# EAGLE design Jacdaptor_FeatherWing-RevC (EAGLE 9.6.2)
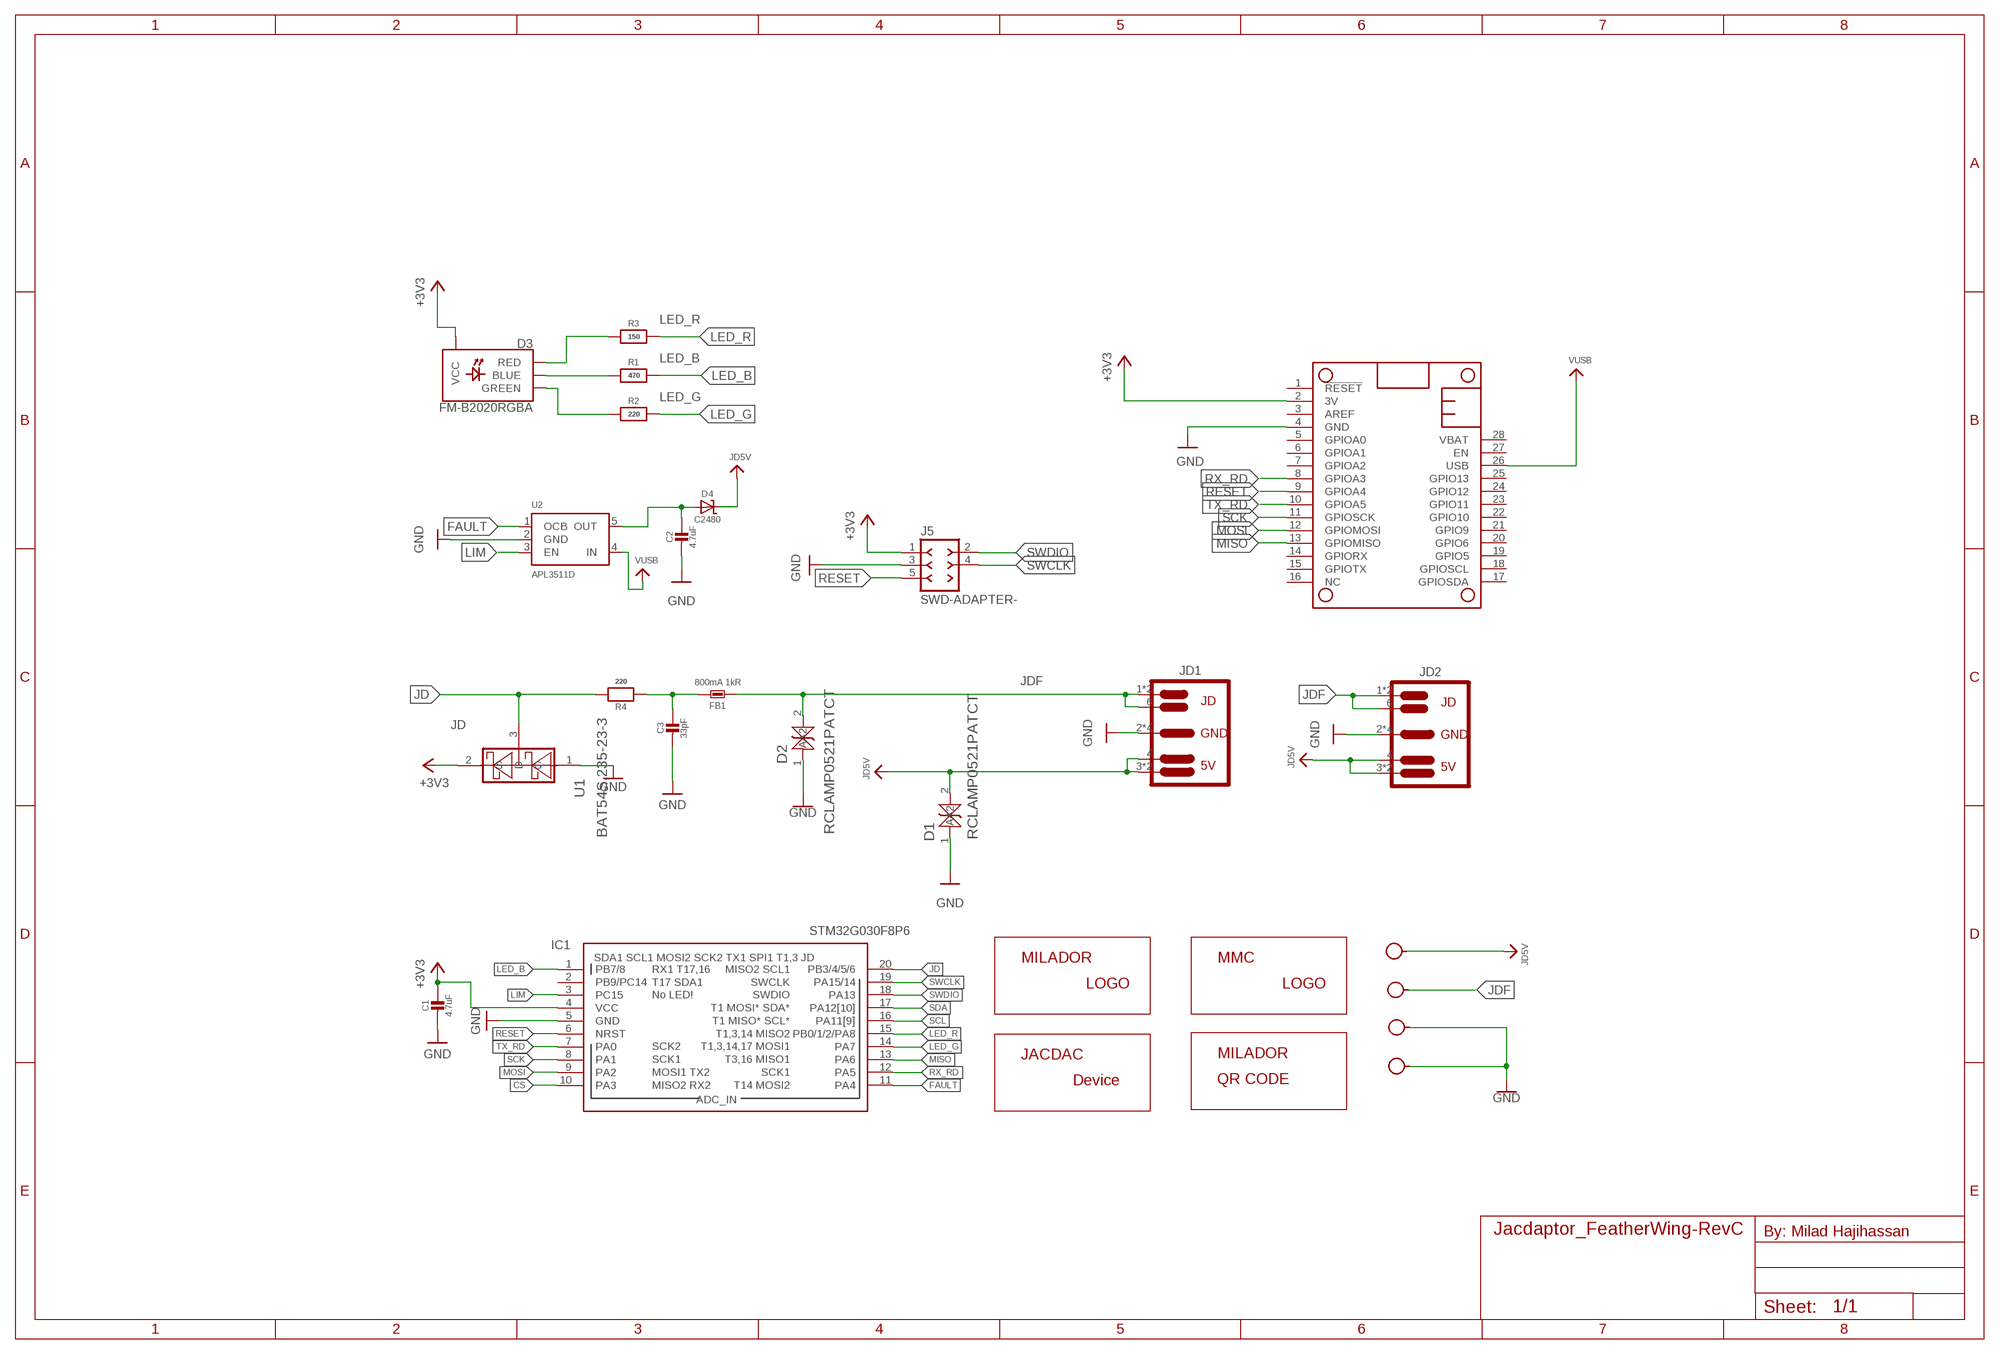
[diagram p0: schematic, sheet 1]

## Parts
C1  4.7uF  CAP_CERAMIC-0603  [0603]
C2  4.7uF  CAP_CERAMIC-0603  [0603]
C3  33pF  CAP_CERAMIC-0603  [0603]
D1  RCLAMP0521PATCT  DIODE-ZENER-AA-RCLAMP0521PATCT  [DIODE-ZENER-0402]
D2  RCLAMP0521PATCT  DIODE-ZENER-AA-RCLAMP0521PATCT  [DIODE-ZENER-0402]
D3  FM-B2020RGBA  LED-RGB-2121-CA  [LED-RGB-2121]
D4  C2480  DIODE-SCHOTTKY-DO214AC  [DO214AC]
FB1  800mA 1kR  FERRITE-BEAD-0603-NO  [0603-NO]
IC1  STM32G030F8P6  [SOP65P640X120-20N]
J1  JACDAC-M3-DATA  [M3-HOLE-DATA]
J2  JACDAC-M3-PWR  [M3-HOLE-PWR]
J3  JACDAC-M3-GND  [M3-HOLE-GND]
J4  JACDAC-M3-GND  [M3-HOLE-GND]
J5  SWD-ADAPTER-  [SWD-ADAPTER]
JD1  JACDAC-EDGE-INNIE  [JD-EDGE-INNIE]
JD2  JACDAC-EDGE-INNIE  [JD-EDGE-INNIE]
LABEL_DEVICE  MILADOR-JACDAC-DEVICE-JACDAPTOR-WING  [JACDAPTOR-FEATHERWING]
LABEL_LOGO  MILADOR-LOGO-SM  [MILADOR_LOGO2]
LABEL_MMC  MMC_LOGO-XSM  [MMC_X-SMALL_LOGO]
LABEL_QR_CODE  MILADOR-QR-CODE-JACDAC-FEATHERWING  [MILADOR_QR_JACDAC_FEATHERWING]
MS1  ADAFRUIT_FEATHERWING_NODIM  [ADAFRUIT_FEATHERWING_DIM]
R1  470  RESISTOR-0603  [0603]
R2  220  RESISTOR-0603  [0603]
R3  150  RESISTOR-0603  [0603]
R4  220  RESISTOR-0603  [0603]
U1  BAT54S,235-23-3  [SOT23-3]
U2  APL3511D  [SOT23-5]

## Nets
+3V3: C1.1 D3.PLUS(VCC) IC1.4(VCC) J5.1(VCC_1) MS1.2(3V) U1.2(S)
CS: IC1.10(PA3)
FAULT: IC1.11(PA4) U2.1(OCB)
GND: C1.2 C2.2 C3.2 D1.1(A) D2.1(A) IC1.5(GND) J3.H J4.H J5.3(GND_3) JD1.2 JD1.5 JD1.P$2 JD1.P$4 JD2.2 JD2.5 JD2.P$2 JD2.P$4 MS1.4(GND) U1.1(G) U2.2(GND)
JD: IC1.20(PB3/4/5/6) R4.2 U1.3(D)
JD5V: D1.2(A2) D4.C J2.H JD1.3 JD1.4 JD1.P$1 JD2.3 JD2.4 JD2.P$1
JDF: D2.2(A2) FB1.2 J1.H JD1.1 JD1.6 JD1.P$3 JD2.1 JD2.6 JD2.P$3
LED_B: IC1.1(PB7/8) R1.2
LED_G: IC1.14(PA7) R2.2
LED_R: IC1.15(PB0/1/2/PA8) R3.2
LIM: IC1.3(PC15) U2.3(EN)
MISO: IC1.13(PA6) MS1.13(GPIOMISO)
MOSI: IC1.9(PA2) MS1.12(GPIOMOSI)
N$1: D3.B-(BLUE) R1.1
N$2: D3.G-(GREEN) R2.1
N$3: D3.R-(RED) R3.1
N$4: C3.1 FB1.1 R4.1
OUT: C2.1 D4.A U2.5(OUT)
RESET: IC1.6(NRST) J5.5(RESET_5) MS1.9(GPIOA4)
RX_RD: IC1.12(PA5) MS1.8(GPIOA3)
SCK: IC1.8(PA1) MS1.11(GPIOSCK)
SCL: IC1.16(PA11[9])
SDA: IC1.17(PA12[10])
SWCLK: IC1.19(PA15/14) J5.4(SWCLK_4)
SWDIO: IC1.18(PA13) J5.2(SWDIO_2)
TX_RD: IC1.7(PA0) MS1.10(GPIOA5)
VUSB: MS1.26(USB) U2.4(IN)
Unconnected: IC1.2(PB9/PC14) MS1.1(!RESET) MS1.3(AREF) MS1.5(GPIOA0) MS1.6(GPIOA1) MS1.7(GPIOA2) MS1.14(GPIORX) MS1.15(GPIOTX) MS1.16(NC) MS1.17(GPIOSDA) MS1.18(GPIOSCL) MS1.19(GPIO5) MS1.20(GPIO6) MS1.21(GPIO9) MS1.22(GPIO10) MS1.23(GPIO11) MS1.24(GPIO12) MS1.25(GPIO13) MS1.27(EN) MS1.28(VBAT)

## Notes on the sheet
- By: Milad Hajihassan

## Library data of the parts
C1-C3 = milador_SMD:CAP_CERAMIC-: Ceramic Capacitors For new designs, use the packages preceded by an '_' character since they are more reliable: The following footprints should be used on most boards: _0402 - Standard footprint for regular board layouts _0603 - Standard footprint for regular board layouts _0805 - Standard footprint for regular board layouts _1206 - Standard footprint for regular board layouts For extremely tight-pitch boards where space is at a premium, the following 'micro-pitch' footprints can be used (smaller pads, no silkscreen outline, etc.): _0402MP - Micro-pitch footprint for very dense/compact boards _0603MP - Micro-pitch footprint for very dense/compact boards _0805MP - Micro-pitch footprint for very dense/compact boards _1206MP - Micro-pitch footprint for very dense/compact boards
D1 D2 = milador_SMD:DIODE-ZENER-AA-; COPYRIGHT: Copyright (C) 2021 Ultra Librarian. All rights reserved.; DIGI-KEY_PART_NUMBER_1: RCLAMP0521PACT-ND; DIGI-KEY_PART_NUMBER_2: RCLAMP0521PADKR-ND; DIGI-KEY_PART_NUMBER_3: RCLAMP0521PATR-ND; MANUFACTURER_PART_NUMBER: RCLAMP0521PATCT; MFR_NAME: Semtech
D3 = milador_SMD:LED-RGB-2121-CA: RGB LED, common anode
D4 = milador_SMD:DIODE-SCHOTTKY-
FB1 = milador_SMD:FERRITE-BEAD-: Ferrite Beads
IC1 = milador_SMD:STM32G030F8P6: STM32G030F6P6 TSSOP-20 JLC724040
J1-J4 = milador:JACDAC-M3: Jacdac mounting Hole M3
J5 = milador:SWD-ADAPTER-
JD1 JD2 = milador:JACDAC-EDGE
LABEL_DEVICE = milador:MILADOR-JACDAC-DEVICE-
LABEL_LOGO = milador:MILADOR-LOGO-
LABEL_MMC = MMC Eagle:MMC_LOGO-
LABEL_QR_CODE = milador:MILADOR-QR-CODE-
MS1 = milador:ADAFRUIT_FEATHERWING
R1-R4 = milador_SMD:RESISTOR-: Resistors For new designs, use the packages preceded by an '_' character since they are more reliable: The following footprints should be used on most boards: _0402 - Standard footprint for regular board layouts _0603 - Standard footprint for regular board layouts _0805 - Standard footprint for regular board layouts _1206 - Standard footprint for regular board layouts For extremely tight-pitch boards where space is at a premium, the following 'micro-pitch' footprints can be used (smaller pads, no silkscreen outline, etc.): _0402MP - Micro-pitch footprint for very dense/compact boards _0603MP - Micro-pitch footprint for very dense/compact boards _0805MP - Micro-pitch footprint for very dense/compact boards _1206MP - Micro-pitch footprint for very dense/compact boards
U1 = milador_SMD:BAT54S,235: BAT54S,235 Schottky Diode
U2 = milador_SMD:APL3511D

## Board
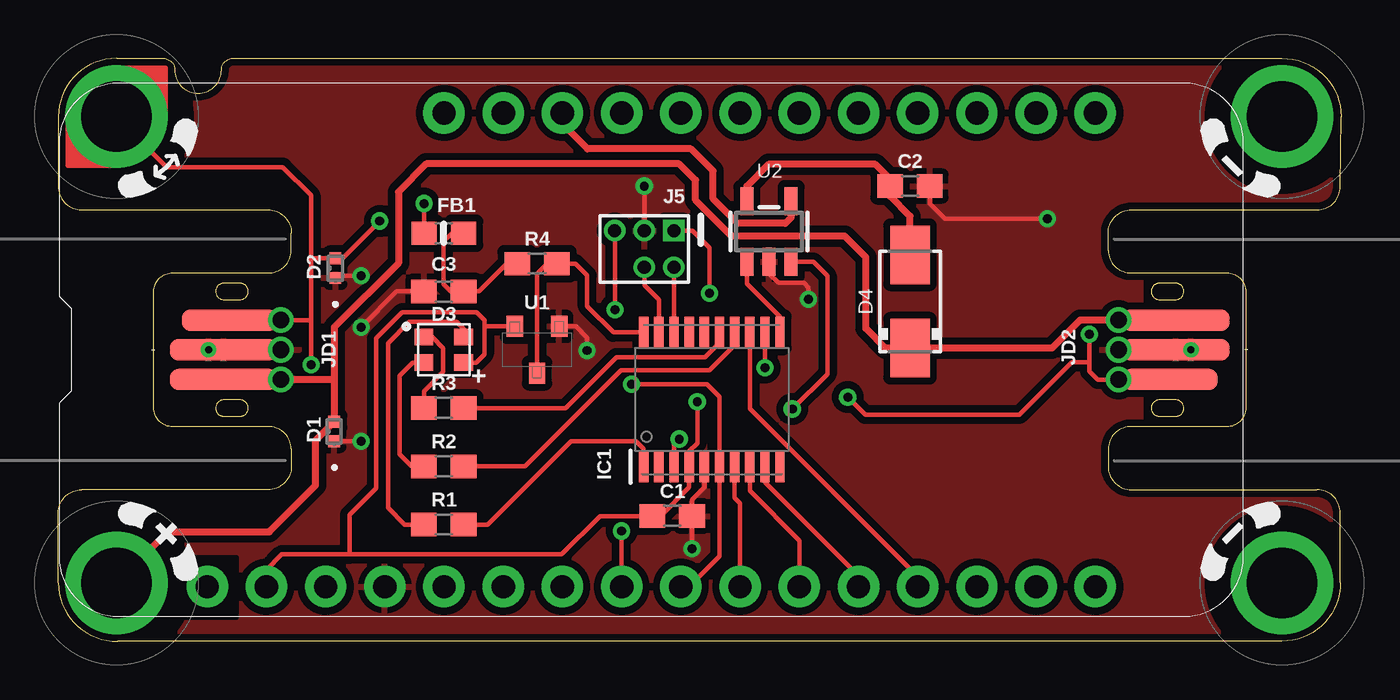
[diagram p1: board, top side]
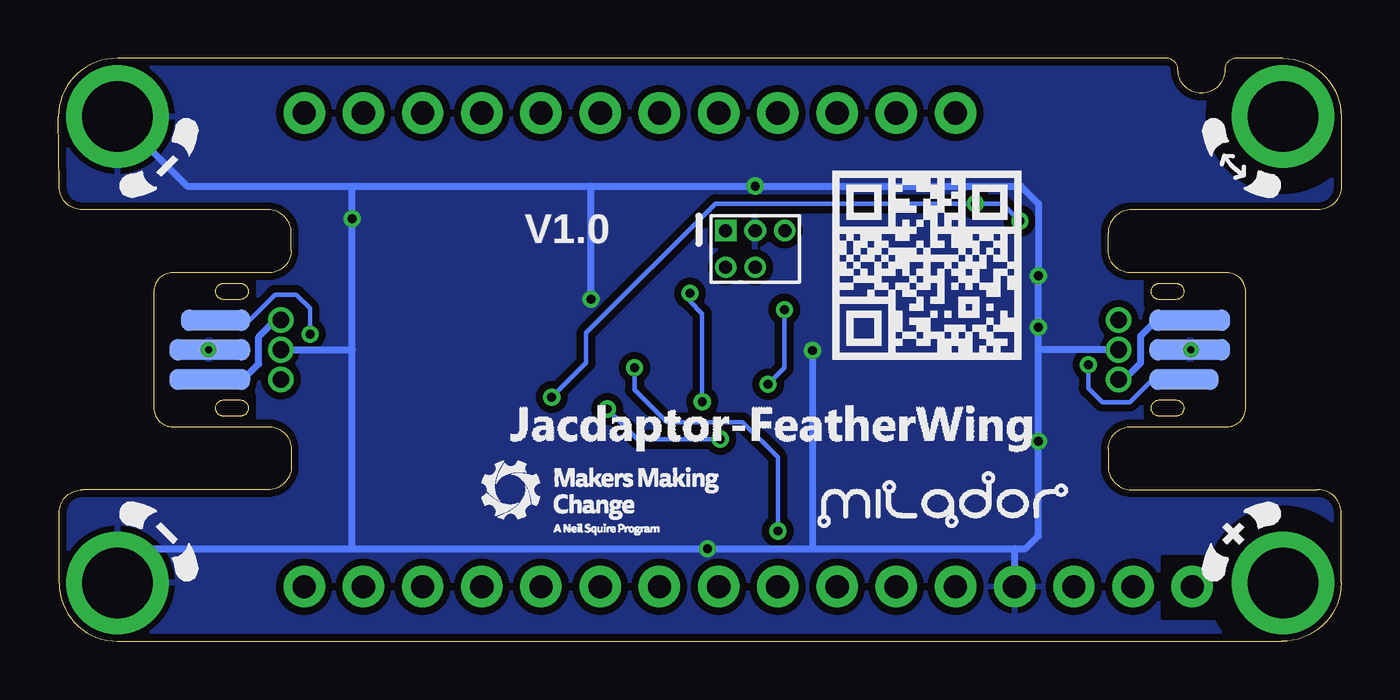
[diagram p2: board, bottom side, seen from below]

Size 55.04 x 25 mm. Coordinates in mm from the lower left corner, seen from the top.
Outline: 10,17.5 arc90 9,18.5 1,18.5 arc-90 0,19.5 0,22.5 arc-90 2.5,25 4.5,25 arc-90 5,24.5 arc90 6,23.5 arc90 7,24.5 arc-90 7.5,25 52.5,25 arc-90 55.04,22.5 55,19.5 arc-90 54,18.5 46.04,18.5 arc90 45.04,17.5
Outline: 10,7.5 arc-90 9,6.5 1,6.5 arc90 0,5.5 0,2.5 arc90 2.54,0 52.5,0 arc90 55,2.5 55,5.5 arc90 54,6.5 46.04,6.5 arc-90 45.04,7.5
Copper layers (1*16): Top 0.035mm / dielectric 1.5mm / Bottom 0.035mm
Design rules "SparkFun-2-layer-TIGHT *": minimum track width 7mil, minimum drill 15mil, track to track 1mil, track to pad 1mil, pad to pad 1mil, via to via 1mil, smd to smd 1mil, copper to edge 1mil, drill to drill 1mil, minimum pad ring 7mil, minimum via ring 7mil, stop-mask expansion 4mil, vias tented up to drill 25mil, thermal gap 10mil

### Footprints (pad centres in the part's own frame; a part is rotated, then mirrored left to right if it is on the bottom)
0603 = smd 1.1 x 1: 1 -0.85,0; 2 0.85,0
DIODE-ZENER-0402 = smd 0.508 x 0.508: 1 -0.419,0; 2 0.419,0
LED-RGB-2121 = smd 0.8 x 0.7: B- 0.85,0.55; G- -0.85,-0.55; PLUS 0.85,-0.55; R- -0.85,0.55
DO214AC = smd 2.5 x 1.7: A 2,0; C -2,0
0603-NO = smd 1.075 x 1: 1 -0.85,0; 2 0.85,0
SOP65P640X120-20N = smd 0.4 x 1.35: 1 -2.925,-2.875; 2 -2.275,-2.875; 3 -1.625,-2.875; 4 -0.975,-2.875; 5 -0.325,-2.875; 6 0.325,-2.875; 7 0.975,-2.875; 8 1.625,-2.875; 9 2.275,-2.875; 10 2.925,-2.875; 11 2.925,2.875; 12 2.275,2.875; 13 1.625,2.875; 14 0.975,2.875; 15 0.325,2.875; 16 -0.325,2.875; 17 -0.975,2.875; 18 -1.625,2.875; 19 -2.275,2.875; 20 -2.925,2.875
M3-HOLE-DATA = drill 3.03 pad 4.4: H 0,0
M3-HOLE-PWR = drill 3.03 pad 4.4: H 0,0
M3-HOLE-GND = drill 3.03 pad 4.4: H 0,0
SWD-ADAPTER = drill 0.559 pad 0.864 square: 1 0,0 | drill 0.559 pad 0.864: 2 0,1.575; 3 1.27,0; 4 1.27,1.575; 5 2.54,0
JD-EDGE-INNIE = smd 0.9 x 4.1: 1 1.27,-3.25 | smd 0.9 x 4.6: 2 0,-3; 3 -1.27,-3 | smd 0.9 x 3.45 bottom: 4 1.27,-2.4; 5 0,-2.4 | smd 0.9 x 2.95 bottom: 6 -1.27,-2.65 | drill 0.71 pad 1.1: P$1 -1.27,-5.45; P$2 0,-5.45; P$3 1.27,-5.45 | drill 0.305 pad 0.559: P$4 0,-2.35
ADAFRUIT_FEATHERWING_DIM = drill 1 pad 1.778: 1 6.35,1.27; 2 8.89,1.27; 3 11.43,1.27; 4 13.97,1.27; 5 16.51,1.27; 6 19.05,1.27; 7 21.59,1.27; 8 24.13,1.27; 9 26.67,1.27; 10 29.21,1.27; 11 31.75,1.27; 12 34.29,1.27; 13 36.83,1.27; 14 39.37,1.27; 15 41.91,1.27; 16 44.45,1.27; 17 44.45,21.59; 18 41.91,21.59; 19 39.37,21.59; 20 36.83,21.59; 21 34.29,21.59; 22 31.75,21.59; 23 29.21,21.59; 24 26.67,21.59; 25 24.13,21.59; 26 21.59,21.59; 27 19.05,21.59; 28 16.51,21.59
SOT23-3 = smd 0.9 x 0.7: 1 1,-0.95; 2 1,0.95; 3 -1,0
SOT23-5 = smd 0.55 x 1.2: 1 -0.95,-1.3; 2 0,-1.3; 3 0.95,-1.3; 4 0.95,1.3; 5 -0.95,1.3

### Placement (x,y rotation side)
C1  26.34,5.37 0 top
C2  36.54,19.52 0 top
C3  16.54,15 180 top
D1  11.84,9 90 top
D2  11.89,16 90 top
D3  16.54,12.5 0 top
D4  36.54,14.57 90 top
FB1  16.54,17.5 180 top
IC1  28.04,10.37 0 top
J1  2.5,22.5 0 top
J2  2.5,2.5 0 top
J3  52.5,2.5 0 top
J4  52.5,22.5 90 top
J5  26.41,17.61 180 top
JD1  4.1,12.5 90 top
JD2  50.94,12.5 270 top
LABEL_DEVICE  24.54,9.27 0 bottom
LABEL_LOGO  17.79,5.57 0 bottom
LABEL_MMC  31.89,4.57 0 bottom
LABEL_QR_CODE  17.79,12.07 0 bottom
MS1  0.04,1.07 0 top
R1  16.54,5 0 top
R2  16.54,7.5 0 top
R3  16.54,10 0 top
R4  20.54,16.19 0 top
U1  20.54,12.5 90 top
U2  30.49,17.57 0 top

### Tracks (layer width: path | path; a pad name or v marks a point on that pad's centre or on a via)
+3V3  (via drill 0.38)
  Top 0.2: v27.41,10.27 27.41,8.49 27.07,8.14 IC1.4 27.07,6.59 25.84,5.37 C1.1 23.24,5.37 21.59,3.72 12.49,3.72 | v27.94,14.92 27.94,16.87 27.2,17.61 J5.1 | MS1.2 8.93,3.06 9.59,3.72 12.49,3.72 | 12.49,3.72 12.49,5.42 13.64,6.57 13.64,12.99 14.76,14.1 17.93,14.1 18.28,13.76 18.28,13.52 | 18.28,13.52 18.28,12.32 17.91,11.95 D3.PLUS | U1.2 18.3,13.5 18.28,13.52
  Bottom 0.2: v27.41,10.27 27.41,14.04 27.94,14.57 v27.94,14.92
FAULT
  Top 0.2: U2.1 29.54,15.33 30.96,13.91 IC1.11
GND  (via drill 0.38)
  Top 0.178: JD2.P$2 JD2.2 JD2.P$4 | JD1.P$4 JD1.2 JD1.P$2
  Top 0.2: J5.3 v25.14,19.52 | D2.1 11.98,15.67 v12.99,15.67 | C3.2 14.52,15 v12.99,13.47 | v27.19,3.97 C1.2 27.19,6.07 27.71,6.59 IC1.5 | D1.1 12.98,8.58 v12.99,8.57 | C2.2 37.39,18.77 38.04,18.12 v42.43,18.12 | v22.69,12.47 22.69,13.02 22.21,13.5 U1.1 | U2.2 30.49,15.77 30.89,15.37 31.99,15.37 32.19,15.17 v32.19,14.67 | IC1.5 27.71,7.91 27.62,8 27.62,7.59 IC1.5
  Bottom 0.305: 42.43,19.52 32.19,19.52 | 32.19,19.52 v25.14,19.52 13.74,19.52 12.99,18.77 v12.99,15.67 v12.99,13.47 12.99,12.5 | JD1.P$2 12.99,12.5 | MS1.4 14.01,3.97 | 14.01,3.97 13.54,3.97 12.99,4.52 v12.99,8.57 12.99,12.5 | 42.43,3.97 v27.19,3.97 22.64,3.97 | 22.64,3.97 14.01,3.97 | J4.H 49.52,19.52 42.43,19.52 | 42.43,3.97 42.43,12.52 | 42.43,12.52 v42.43,18.12 42.43,19.52 | JD2.P$2 42.45,12.5 42.43,12.52 | v22.69,12.47 22.69,4.02 22.64,3.97 | v32.19,14.67 32.19,19.52 | J3.H 51.03,3.97 42.43,3.97
  pour Bottom (isolate 0.305): 55,25 55,0 0,0 0,25
  pour Top (isolate 0.305): 55,25 55,0 0,0 0,25
  cutout Top: 5.12,3.61 7.66,3.61 7.66,1 5.12,1
  cutout Bottom: 5.12,3.61 7.66,3.61 7.66,1 5.12,1
JD
  Top 0.2: U1.3 20.54,15.77 20.96,16.19 R4.2 22.19,16.19 22.69,15.69 22.69,14.37 23.82,13.24 IC1.20
JD5V
  Top 0.178: JD2.3 JD2.P$1
  Top 0.305: JD2.P$1 43.83,13.77 42.63,12.57 D4.C 35.49,12.57 34.64,13.42 34.64,16.47 33.74,17.37 28.89,17.37 27.34,18.92 27.34,19.77 26.64,20.47 15.79,20.47 14.59,19.27 14.59,16.22 11.84,13.47 11.84,11.23 | 11.84,11.23 D1.2 11.04,8.62 11.04,6.68 9.05,4.69 4.69,4.69 J2.H | 11.84,11.23 JD1.P$1 JD1.3
  Bottom 0.305: JD1.P$1 9.3,11.23 8.6,11.93 8.6,13.1 7.93,13.77 JD1.4 | JD2.P$1 45.74,13.77 46.44,13.07 46.44,11.9 47.11,11.23 JD2.4
JDF  (via drill 0.38)
  Top 0.2: JD2.P$3 JD2.1 JD2.P$3 | JD2.P$3 44.59,11.22 44.24,11.57 44.24,11.97 | JD1.1 JD1.P$3 10.85,13.77 | 10.85,13.77 v10.85,11.86 | 10.85,16.42 10.85,13.77 | J1.H | J1.H 4.65,20.34 9.63,20.34 10.85,19.12 10.85,16.42 | 10.85,16.42 D2.2 12.19,16.42 v13.79,18.02 | v44.24,13.17 44.24,11.97 | v33.87,10.47 34.62,9.72 41.23,9.72 43.48,11.97 44.24,11.97 | FB1.2 v15.69,18.77
  Bottom 0.178: JD1.6 7.93,11.23
  Bottom 0.2: v10.85,11.86 10.85,10.85 10.25,10.25 9.07,10.25 8.09,11.23 7.93,11.23 | v44.24,13.17 44.24,14.27 44.84,14.87 45.74,14.87 46.84,13.77 JD2.6 | v33.87,10.47 32.39,11.95 32.39,13.22 26.84,18.77 v15.69,18.77 14.54,18.77 v13.79,18.02
LED_B
  Top 0.2: R1.2 18.42,5 21.99,8.57 24.79,8.57 25.11,8.24 IC1.1
LED_G
  Top 0.2: R2.2 20.02,7.5 24.14,11.62 27.94,11.62 29.02,12.7 IC1.14
LED_R
  Top 0.2: R3.2 21.77,10 23.94,12.17 27.74,12.17 28.36,12.79 IC1.15
LIM  (via drill 0.38)
  Top 0.2: U2.3 32.39,16.27 32.99,15.67 32.99,11.46 v31.49,9.96 | v26.64,8.67 26.41,8.45 IC1.3
  Bottom 0.2: v31.49,9.96 30.2,8.67 v26.64,8.67
MISO
  Top 0.2: MS1.13 36.87,2.77 29.66,9.97 IC1.13
MOSI
  Top 0.2: MS1.12 34.33,2.81 30.32,6.83 IC1.9
N$1
  Top 0.2: R1.1 14.86,5 14.14,5.72 14.14,12.79 15.06,13.7 17.08,13.7 17.39,13.39 D3.B-
N$2
  Top 0.2: R2.1 15.16,7.5 14.64,8.02 14.64,11.39 15.2,11.95 D3.G-
N$3
  Top 0.2: R3.1 15.69,10.72 16.51,11.55 16.51,12.57 16.03,13.05 D3.R-
N$4
  Top 0.2: R4.1 19.24,16.19 18.05,15 C3.1 16.84,15 16.54,15.3 16.54,17.15 16.89,17.5 FB1.1
OUT
  Top 0.305: U2.5 29.54,19.52 30.47,20.45 35.06,20.45 35.69,19.82 C2.1 35.69,19.08 36.54,18.23 D4.A
RESET  (via drill 0.38)
  Top 0.2: v23.89,14.22 23.89,17.59 J5.5 | v24.59,11.02 27.84,11.02 28.36,10.49 IC1.6 28.36,3.65 27.05,2.34 MS1.9
  Bottom 0.2: v24.59,11.02 23.89,11.72 v23.89,14.22
RX_RD  (via drill 0.38)
  Top 0.2: MS1.8 v24.17,4.73 | IC1.12 v30.32,11.73
  Bottom 0.2: v24.17,4.73 24.17,7.89 25.68,9.4 28.93,9.4 30.32,10.79 v30.32,11.73
SCK
  Top 0.2: MS1.11 31.79,4.32 29.66,6.45 IC1.8
SWCLK
  Top 0.2: J5.4 25.14,15.27 25.77,14.64 IC1.19
SWDIO
  Top 0.2: IC1.18 J5.2
TX_RD
  Top 0.2: MS1.10 29.25,5.91 29.02,6.14 IC1.7
VUSB
  Top 0.305: MS1.26 21.63,22.19 22.7,21.12 27.14,21.12 28.09,20.17 28.09,18.97 29.14,17.92 31.19,17.92 31.44,18.17 U2.4

### Text on the board
bPlace: V1.0